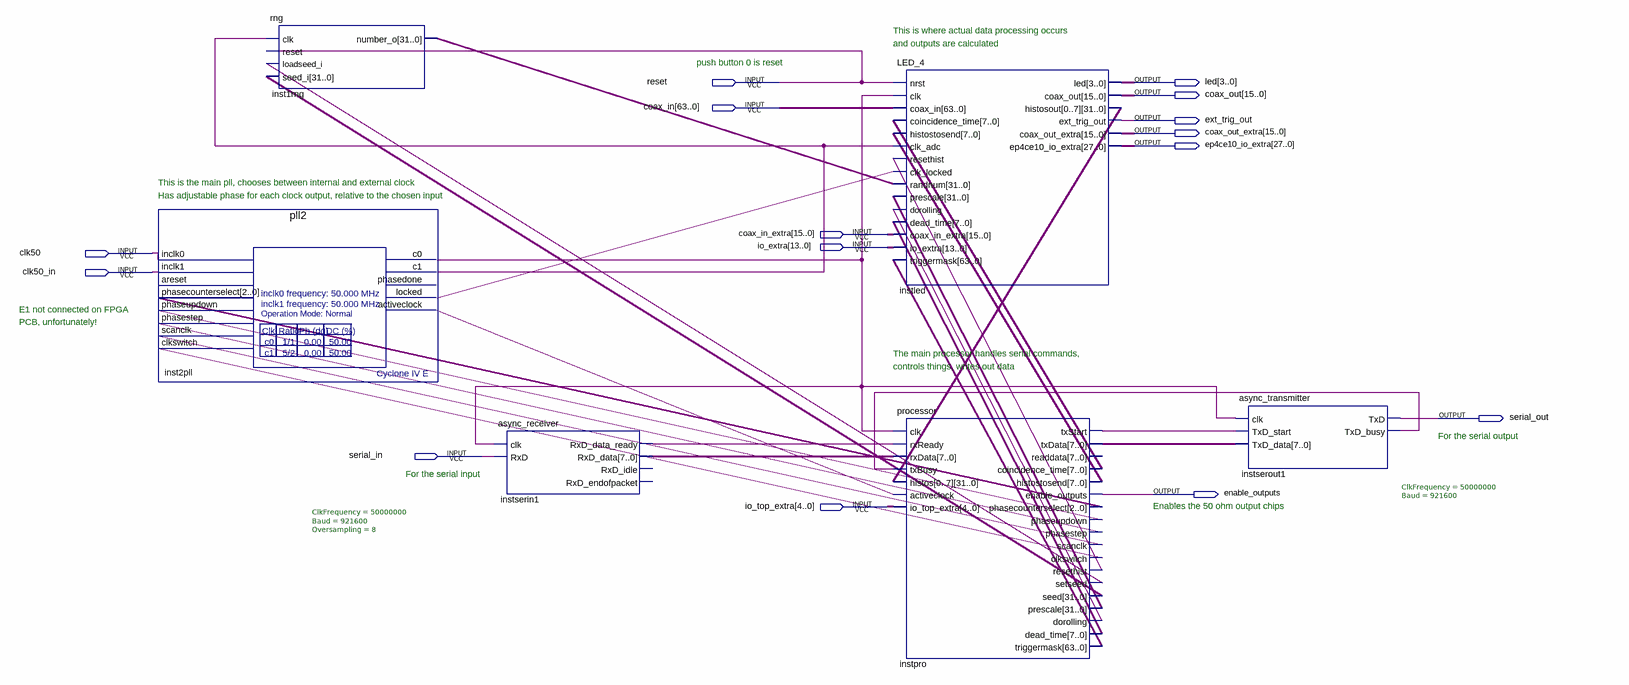
[diagram p0: schematic sheet]
// Quartus schematic coincidence.bdf as structural Verilog: 6 symbols, 15 pins
module coincidence (
  input  reset,
  input  [63:0] coax_in,
  input  [15:0] coax_in_extra,
  input  [13:0] io_extra,
  input  clk50,
  input  clk50_in,
  input  serial_in,
  input  [4:0] io_top_extra,
  output [3:0] led,
  output [15:0] coax_out,
  output ext_trig_out,
  output [15:0] coax_out_extra,
  output [27:0] ep4ce10_io_extra,
  output serial_out,
  output enable_outputs
);

  wire inst2pll_activeclock, inst2pll_c0, inst2pll_c1, inst2pll_locked, instpro_clkswitch, instpro_dorolling,
       instpro_phasestep, instpro_phaseupdown, instpro_resethist, instpro_scanclk, instpro_setseed,
       instpro_txstart, instserin1_rxd_data_ready, instserout1_txd_busy;
  wire [2:0] instpro_phasecounterselect;
  wire [7:0] instpro_coincidence_time, instpro_dead_time, instpro_histostosend, instpro_txdata,
       instserin1_rxd_data;
  wire [31:0] inst1rng_number_o, instpro_prescale, instpro_seed;
  wire [63:0] instpro_triggermask;
  wire [255:0] instled_histosout;

  pll2 inst2pll (
    .inclk0(clk50), .inclk1(clk50_in), .phasecounterselect(instpro_phasecounterselect),
    .phaseupdown(instpro_phaseupdown), .phasestep(instpro_phasestep), .scanclk(instpro_scanclk),
    .clkswitch(instpro_clkswitch), .c0(inst2pll_c0), .c1(inst2pll_c1), .locked(inst2pll_locked),
    .activeclock(inst2pll_activeclock));  // open: areset, phasedone
  rng inst1rng (
    .clk(inst2pll_c1), .reset(reset), .loadseed_i(instpro_setseed), .seed_i(instpro_seed),
    .number_o(inst1rng_number_o));
  async_receiver #(.ClkFrequency(50000000), .Baud(921600), .Oversampling(8)) instserin1 (
    .clk(inst2pll_c0), .RxD(serial_in), .RxD_data_ready(instserin1_rxd_data_ready),
    .RxD_data(instserin1_rxd_data));  // open: RxD_idle, RxD_endofpacket
  LED_4 instled (
    .nrst(reset), .clk(inst2pll_c0), .coax_in(coax_in), .coincidence_time(instpro_coincidence_time),
    .histostosend(instpro_histostosend), .clk_adc(inst2pll_c1), .resethist(instpro_resethist),
    .clk_locked(inst2pll_locked), .randnum(inst1rng_number_o), .prescale(instpro_prescale),
    .dorolling(instpro_dorolling), .dead_time(instpro_dead_time), .coax_in_extra(coax_in_extra),
    .io_extra(io_extra), .triggermask(instpro_triggermask), .led(led), .coax_out(coax_out),
    .histosout(instled_histosout), .ext_trig_out(ext_trig_out), .coax_out_extra(coax_out_extra),
    .ep4ce10_io_extra(ep4ce10_io_extra));
  processor instpro (
    .clk(inst2pll_c0), .rxReady(instserin1_rxd_data_ready), .rxData(instserin1_rxd_data),
    .txBusy(instserout1_txd_busy), .histos(instled_histosout), .activeclock(inst2pll_activeclock),
    .io_top_extra(io_top_extra), .txStart(instpro_txstart), .txData(instpro_txdata),
    .coincidence_time(instpro_coincidence_time), .histostosend(instpro_histostosend),
    .enable_outputs(enable_outputs), .phasecounterselect(instpro_phasecounterselect),
    .phaseupdown(instpro_phaseupdown), .phasestep(instpro_phasestep), .scanclk(instpro_scanclk),
    .clkswitch(instpro_clkswitch), .resethist(instpro_resethist), .setseed(instpro_setseed),
    .seed(instpro_seed), .prescale(instpro_prescale), .dorolling(instpro_dorolling),
    .dead_time(instpro_dead_time), .triggermask(instpro_triggermask));  // open: readdata
  async_transmitter #(.ClkFrequency(50000000), .Baud(921600)) instserout1 (
    .clk(inst2pll_c0), .TxD_start(instpro_txstart), .TxD_data(instpro_txdata), .TxD(serial_out),
    .TxD_busy(instserout1_txd_busy));

  // Notes on the sheet:
  //   This is where actual data processing occurs
  //   and outputs are calculated
  //   push button 0 is reset
  //   This is the main pll, chooses between internal and external clock
  //   Has adjustable phase for each clock output, relative to the chosen input
  //   E1 not connected on FPGA
  //   PCB, unfortunately!
  //   The main processor handles serial commands, 
  //   controls things, writes out data
  //   For the serial output
  //   For the serial input
  //   Enables the 50 ohm output chips
endmodule
